# EAGLE design PARAMETRIK (EAGLE 6.6.0)
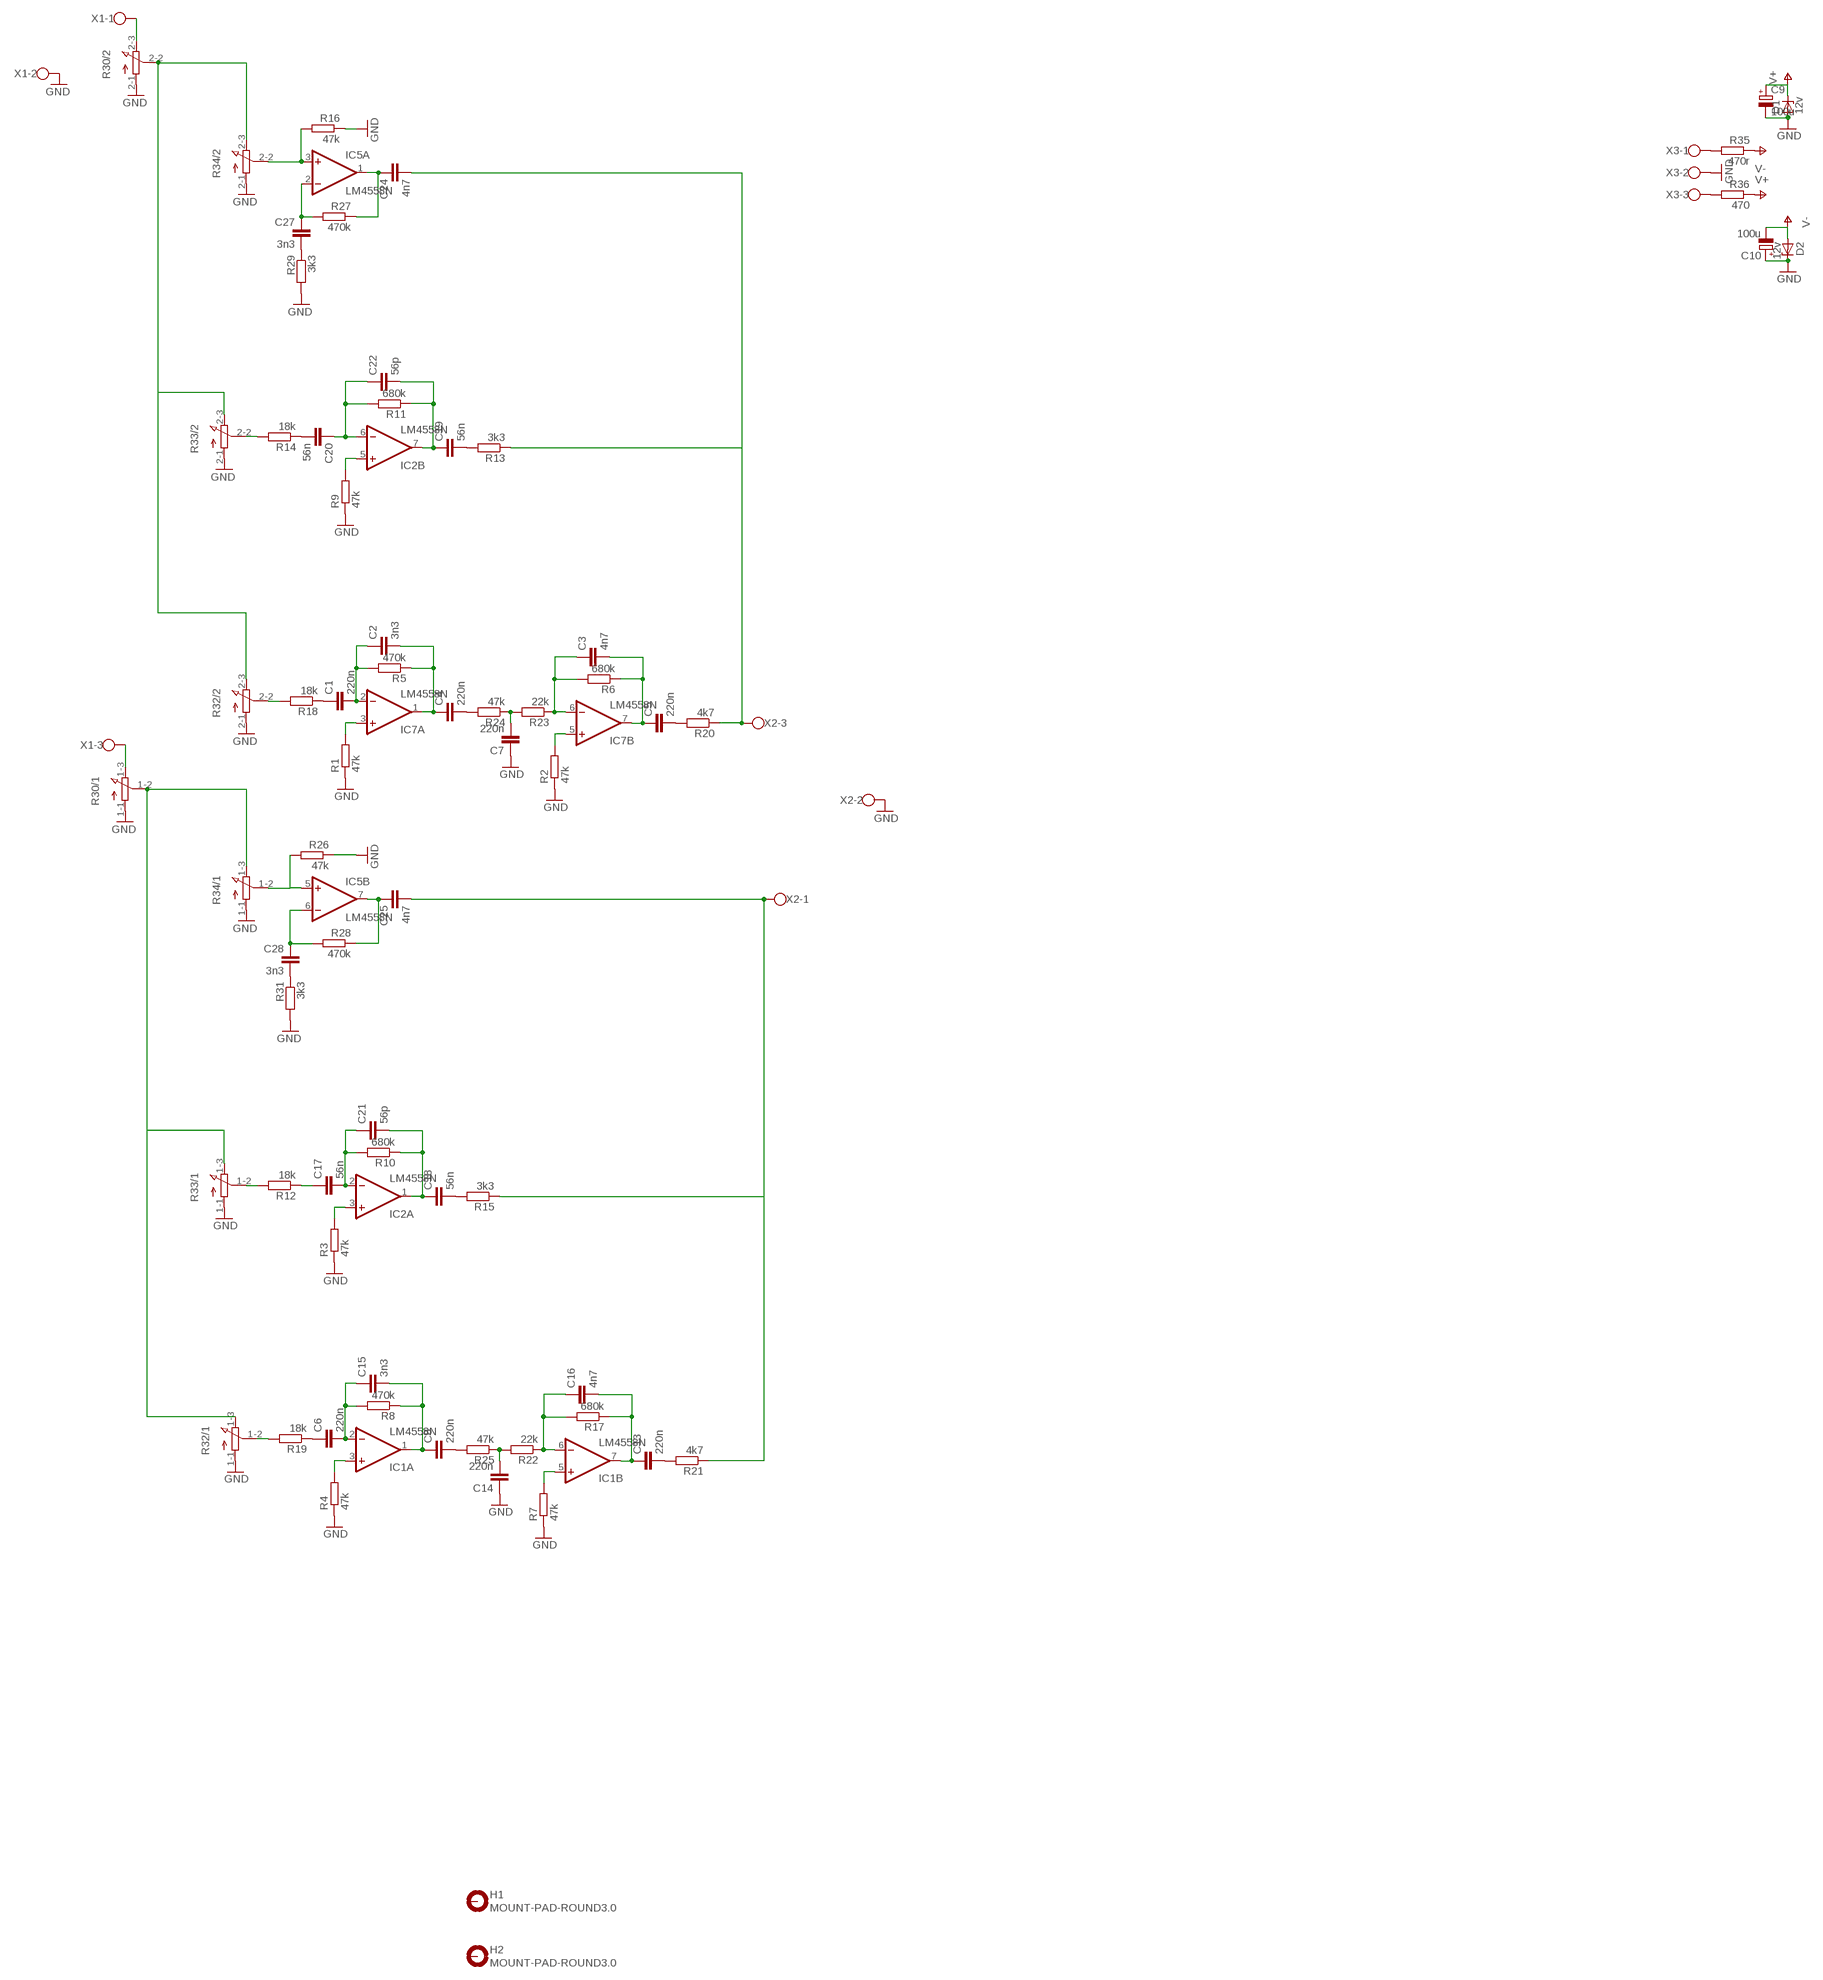
[diagram p0: schematic, sheet 1]

## Parts
C1  220n  C-EU075-032X103  [C075-032X103]
C2  3n3  C-EU025-025X050  [C025-025X050]
C3  4n7  C-EU025-025X050  [C025-025X050]
C4  220n  C-EU075-032X103  [C075-032X103]
C5  220n  C-EU075-032X103  [C075-032X103]
C6  220n  C-EU075-032X103  [C075-032X103]
C7  220n  C-EU075-032X103  [C075-032X103]
C8  220n  C-EU075-032X103  [C075-032X103]
C9  100u  CPOL-EUE2.5-6  [E2,5-6]
C10  100u  CPOL-EUE2.5-6  [E2,5-6]
C13  220n  C-EU075-032X103  [C075-032X103]
C14  220n  C-EU075-032X103  [C075-032X103]
C15  3n3  C-EU025-025X050  [C025-025X050]
C16  4n7  C-EU025-025X050  [C025-025X050]
C17  56n  C-EU075-032X103  [C075-032X103]
C18  56n  C-EU075-032X103  [C075-032X103]
C19  56n  C-EU075-032X103  [C075-032X103]
C20  56n  C-EU075-032X103  [C075-032X103]
C21  56p  C-EU025-025X050  [C025-025X050]
C22  56p  C-EU025-025X050  [C025-025X050]
C24  4n7  C-EU075-032X103  [C075-032X103]
C25  4n7  C-EU075-032X103  [C075-032X103]
C27  3n3  C-EU025-025X050  [C025-025X050]
C28  3n3  C-EU025-025X050  [C025-025X050]
D1  12v  1N821  [DO35Z10]
D2  12v  1N821  [DO35Z10]
H1  MOUNT-PAD-ROUND3.0  [3,0-PAD]
H2  MOUNT-PAD-ROUND3.0  [3,0-PAD]
IC1  LM4558N  [DIL08]
IC2  LM4558N  [DIL08]
IC5  LM4558N  [DIL08]
IC7  LM4558N  [DIL08]
R1  47k  R-EU_0207/10  [0207/10]
R2  47k  R-EU_0207/10  [0207/10]
R3  47k  R-EU_0207/10  [0207/10]
R4  47k  R-EU_0207/10  [0207/10]
R5  470k  R-EU_0207/10  [0207/10]
R6  680k  R-EU_0207/10  [0207/10]
R7  47k  R-EU_0207/10  [0207/10]
R8  470k  R-EU_0207/10  [0207/10]
R9  47k  R-EU_0207/10  [0207/10]
R10  680k  R-EU_0207/10  [0207/10]
R11  680k  R-EU_0207/10  [0207/10]
R12  18k  R-EU_0207/10  [0207/10]
R13  3k3  R-EU_0207/10  [0207/10]
R14  18k  R-EU_0207/10  [0207/10]
R15  3k3  R-EU_0207/10  [0207/10]
R16  47k  R-EU_0207/10  [0207/10]
R17  680k  R-EU_0207/10  [0207/10]
R18  18k  R-EU_0207/10  [0207/10]
R19  18k  R-EU_0207/10  [0207/10]
R20  4k7  R-EU_0207/10  [0207/10]
R21  4k7  R-EU_0207/10  [0207/10]
R22  22k  R-EU_0207/10  [0207/10]
R23  22k  R-EU_0207/10  [0207/10]
R24  47k  R-EU_0207/10  [0207/10]
R25  47k  R-EU_0207/10  [0207/10]
R26  47k  R-EU_0207/10  [0207/10]
R27  470k  R-EU_0207/10  [0207/10]
R28  470k  R-EU_0207/10  [0207/10]
R29  3k3  R-EU_0207/10  [0207/10]
R30  3RP/1610G  [3RP/1610G]
R31  3k3  R-EU_0207/10  [0207/10]
R32  3RP/1610G  [3RP/1610G]
R33  3RP/1610G  [3RP/1610G]
R34  3RP/1610G  [3RP/1610G]
R35  470r  R-EU_0207/10  [0207/10]
R36  470  R-EU_0207/10  [0207/10]
X1  W237-103  [W237-103]
X2  W237-103  [W237-103]
X3  W237-103  [W237-103]

## Nets
GND: C7.1 C9.- C10.+ C14.1 D1.A D2.C R1.1 R2.1 R3.1 R4.1 R7.1 R9.1 R16.1 R26.1 R29.2 R30.1-1(/1:A) R30.2-1(/2:A) R31.2 R32.1-1(/1:A) R32.2-1(/2:A) R33.1-1(/1:A) R33.2-1(/2:A) R34.1-1(/1:A) R34.2-1(/2:A) X1.2 X2.2 X3.2
N$1: IC1.3(A:+IN) R4.2
N$2: IC1.5(B:+IN) R7.2
N$3: IC7.3(A:+IN) R1.2
N$4: IC7.5(B:+IN) R2.2
N$5: C1.2 C2.1 IC7.2(A:-IN) R5.2
N$6: C6.2 C15.1 IC1.2(A:-IN) R8.2
N$7: C8.1 C15.2 IC1.1(A:OUT) R8.1
N$8: C16.1 IC1.6(B:-IN) R17.2 R22.1
N$9: C13.1 C16.2 IC1.7(B:OUT) R17.1
N$10: C2.2 C4.1 IC7.1(A:OUT) R5.1
N$11: C3.1 IC7.6(B:-IN) R6.2 R23.1
N$12: C3.2 C5.1 IC7.7(B:OUT) R6.1
N$13: IC2.3(A:+IN) R3.2
N$14: IC2.5(B:+IN) R9.2
N$15: C17.2 C21.1 IC2.2(A:-IN) R10.2
N$16: C18.1 C21.2 IC2.1(A:OUT) R10.1
N$17: C20.1 C22.1 IC2.6(B:-IN) R11.2
N$18: C19.1 C22.2 IC2.7(B:OUT) R11.1
N$19: C17.1 R12.1
N$20: C19.2 R13.2
N$21: C18.2 R15.2
N$22: C28.2 R31.1
N$23: C20.2 R14.1
N$24: R12.2 R33.1-2(/1:S)
N$25: C6.1 R19.1
N$26: C1.1 R18.1
N$27: C13.2 R21.2
N$28: C5.2 R20.2
N$29: C24.2 R13.1 R20.1 X2.3
N$30: IC5.3(A:+IN) R16.2 R34.2-2(/2:S)
N$31: C8.2 R25.2
N$32: C14.2 R22.2 R25.1
N$33: C4.2 R24.2
N$34: C7.2 R23.2 R24.1
N$35: IC5.5(B:+IN) R26.2 R34.1-2(/1:S)
N$36: C27.1 IC5.2(A:-IN) R27.2
N$37: C24.1 IC5.1(A:OUT) R27.1
N$38: C28.1 IC5.6(B:-IN) R28.2
N$39: C25.1 IC5.7(B:OUT) R28.1
N$40: C27.2 R29.1
N$41: C25.2 R15.1 R21.1 X2.1
N$42: R14.2 R33.2-2(/2:S)
N$43: R19.2 R32.1-2(/1:S)
N$44: R18.2 R32.2-2(/2:S)
N$45: R30.2-2(/2:S) R32.2-3(/2:E) R33.2-3(/2:E) R34.2-3(/2:E)
N$46: R35.2 X3.1
N$47: R30.1-2(/1:S) R32.1-3(/1:E) R33.1-3(/1:E) R34.1-3(/1:E)
N$48: R36.2 X3.3
N$49: R30.2-3(/2:E) X1.1
N$50: R30.1-3(/1:E) X1.3
V+: C9.+ D1.C R36.1
V-: C10.- D2.A R35.1
Unconnected: H1.B3,0(MOUNT) H2.B3,0(MOUNT)

## Power pins joined to a net without a drawn wire
V+: IC1.8(P:V+) IC2.8(P:V+) IC5.8(P:V+) IC7.8(P:V+)
V-: IC1.4(P:V-) IC2.4(P:V-) IC5.4(P:V-) IC7.4(P:V-)

## Library data of the parts
C1-C8 C13-C22 C24 C25 C27 C28 = resistor:C-EU: CAPACITOR, European symbol
C9 C10 = resistor:CPOL-EU: POLARIZED CAPACITOR, European symbol
D1 D2 = diode:1N821: Reference DIODE temperature compensated, 6,2 V
H1 H2 = holes:MOUNT-PAD-ROUND: MOUNTING PAD, round
IC1 IC2 IC5 IC7 = linear:*4558: OP AMP
R1-R29 R31 R35 R36 = resistor:R-EU_: RESISTOR, European symbol
R30 R32-R34 = pot:3RP/1610G: 16mm Potentiometer two level Source: http://www.alphapotentiometers.net/html/16mm_pot_2.html
X1-X3 = con-wago-500:W237-103: WAGO SCREW CLAMP; MPN: 237-103; OC_FARNELL: unknown; OC_NEWARK: 18M7116

## Board
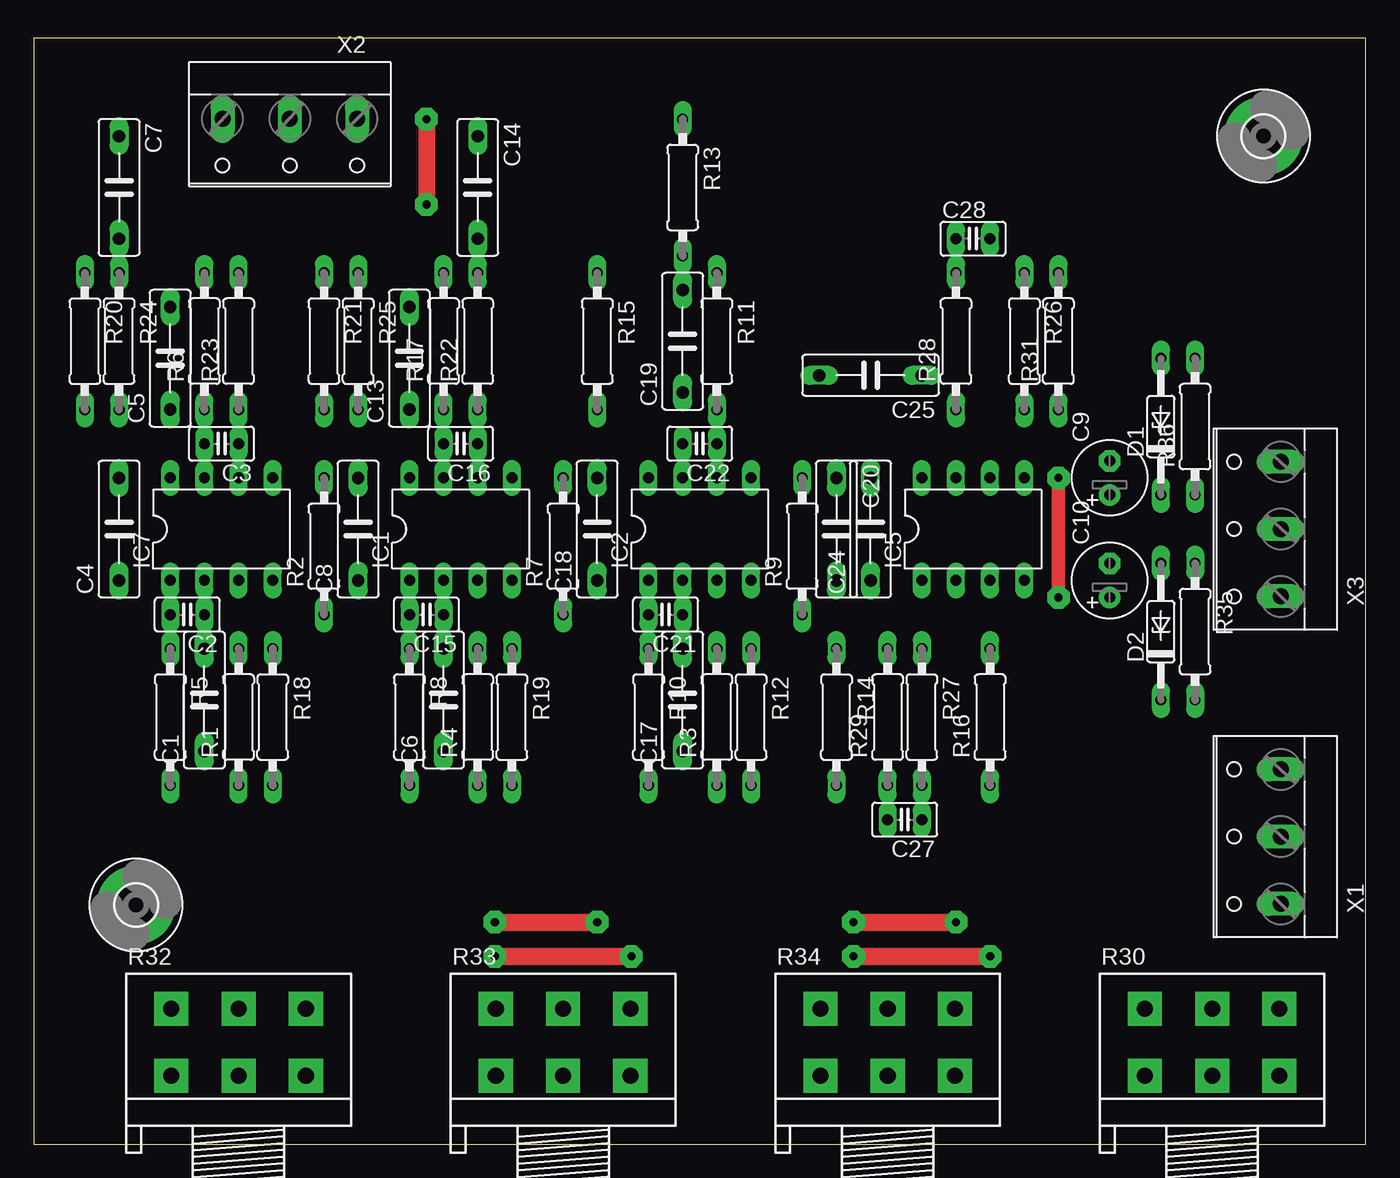
[diagram p1: board, top side]
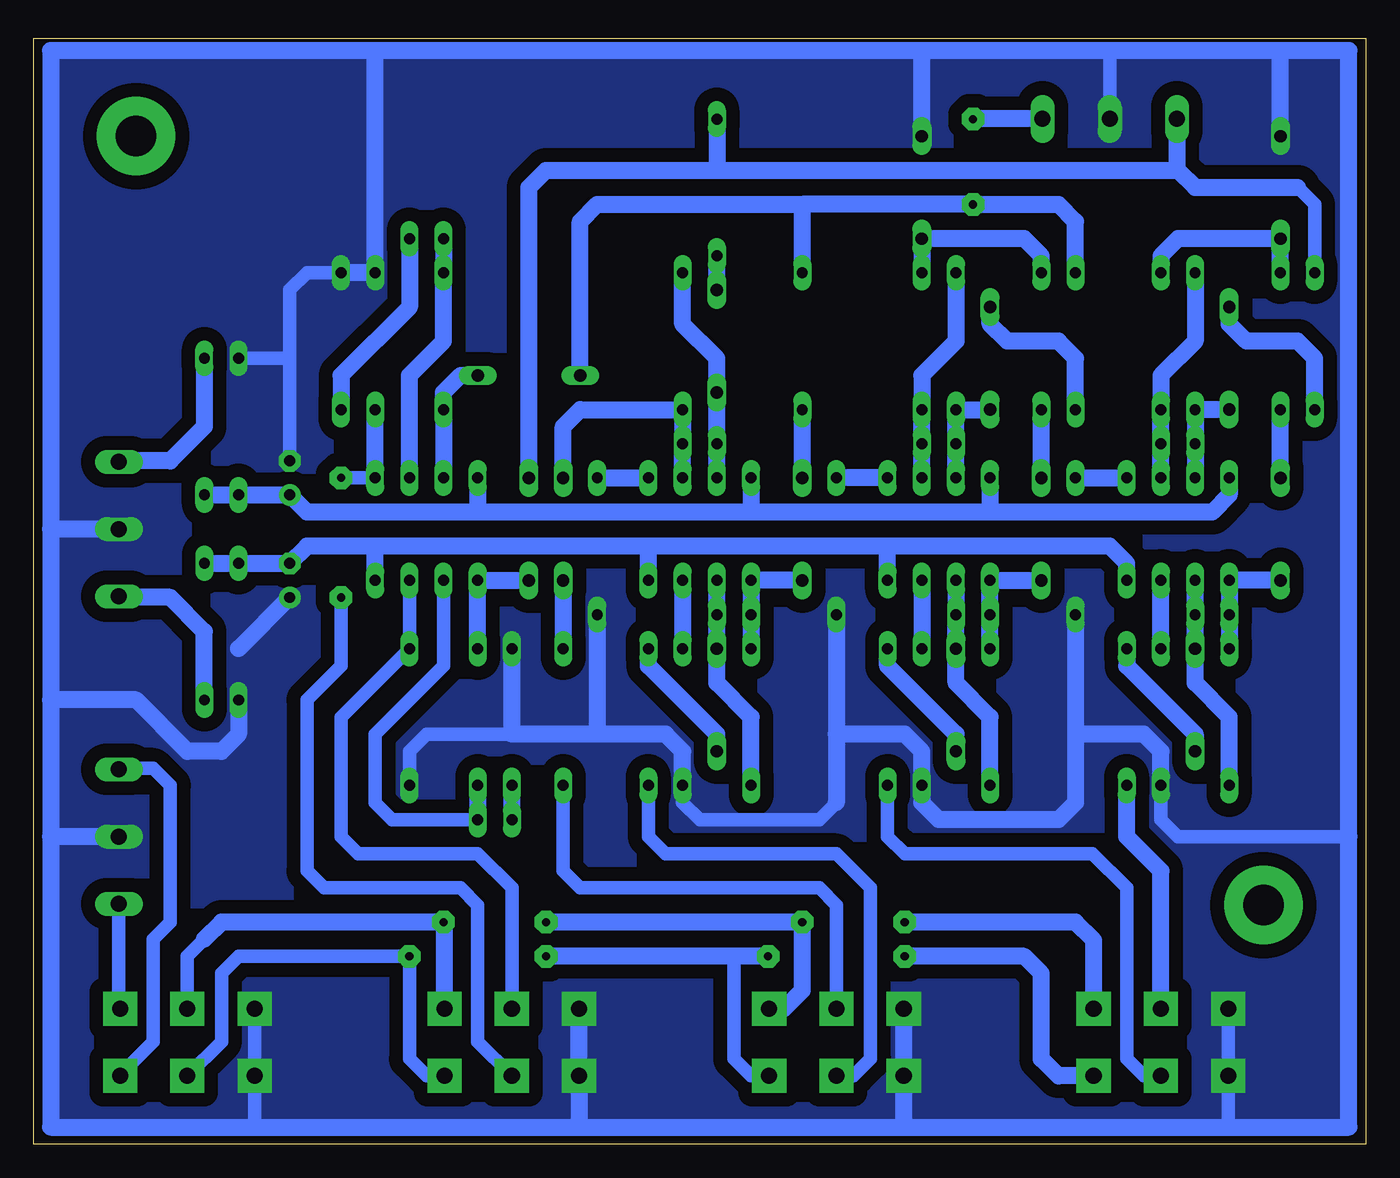
[diagram p2: board, bottom side, seen from below]

Size 99.04 x 82.22 mm. Coordinates in mm from the lower left corner, seen from the top.
Outline: 0,0 99.04,0 99.04,82.22 0,82.22 0,0
Copper layers (1*16): Top 0.035mm / dielectric 1.5mm / Bottom 0.035mm
Design rules "default": minimum track width 10mil, minimum drill 24mil, track to track 8mil, track to pad 8mil, pad to pad 8mil, via to via 8mil, smd to smd 8mil, copper to edge 40mil, drill to drill 8mil, minimum pad ring 10mil, minimum via ring 8mil, stop-mask expansion 4mil, vias tented up to drill 0mil, thermal gap 10mil

### Footprints (pad centres in the part's own frame; a part is rotated, then mirrored left to right if it is on the bottom)
C075-032X103 = drill 0.914 long: 1 -3.81,0; 2 3.81,0
C025-025X050 = drill 0.813 long: 1 -1.27,0; 2 1.27,0
E2,5-6 = drill 0.813 pad 1.6: + -1.27,0 | drill 0.813 pad 1.6 octagon: - 1.27,0
DO35Z10 = drill 0.813 long: A 5.08,0; C -5.08,0
3,0-PAD = drill 3 pad 5.842: B3,0 0,0
DIL08 = drill 0.813 pad 1.27 long: 1 -3.81,-3.81; 2 -1.27,-3.81; 3 1.27,-3.81; 4 3.81,-3.81; 5 3.81,3.81; 6 1.27,3.81; 7 -1.27,3.81; 8 -3.81,3.81
0207/10 = drill 0.813 long: 1 -5.08,0; 2 5.08,0
3RP/1610G = drill 1.2 pad 2.54 square: 1-1 -5,0; 1-2 0,0; 1-3 5,0; 2-1 -5,5; 2-2 0,5; 2-3 5,5
W237-103 = drill 1.194 long: 1 -5,-1.29; 2 0,-1.29; 3 5,-1.29

### Placement (x,y rotation side)
C1  12.7,33.02 90 top
C2  11.43,39.37 180 top
C3  13.97,52.07 180 top
C4  6.35,45.72 90 top
C5  10.16,58.42 90 top
C6  30.48,33.02 90 top
C7  6.35,71.12 270 top
C8  24.13,45.72 90 top
C9  80.01,49.53 90 top
C10  80.01,41.91 90 top
C13  27.94,58.42 90 top
C14  33.02,71.12 270 top
C15  29.21,39.37 180 top
C16  31.75,52.07 180 top
C17  48.26,33.02 90 top
C18  41.91,45.72 90 top
C19  48.26,59.69 90 top
C20  59.69,45.72 270 top
C21  46.99,39.37 180 top
C22  49.53,52.07 180 top
C24  62.23,45.72 90 top
C25  62.23,57.15 180 top
C27  64.77,24.13 180 top
C28  69.85,67.31 0 top
D1  83.82,53.34 90 top
D2  83.82,38.1 90 top
H1  91.44,74.93 0 top
H2  7.62,17.78 0 top
IC1  31.75,45.72 0 top
IC2  49.53,45.72 0 top
IC5  69.85,45.72 0 top
IC7  13.97,45.72 0 top
R1  15.24,31.75 90 top
R2  21.59,44.45 90 top
R3  50.8,31.75 90 top
R4  33.02,31.75 90 top
R5  10.16,31.75 270 top
R6  12.7,59.69 90 top
R7  39.37,44.45 90 top
R8  27.94,31.75 270 top
R9  57.15,44.45 90 top
R10  45.72,31.75 270 top
R11  50.8,59.69 270 top
R12  53.34,31.75 270 top
R13  48.26,71.12 270 top
R14  59.69,31.75 270 top
R15  41.91,59.69 270 top
R16  71.12,31.75 90 top
R17  30.48,59.69 90 top
R18  17.78,31.75 270 top
R19  35.56,31.75 270 top
R20  3.81,59.69 270 top
R21  21.59,59.69 270 top
R22  33.02,59.69 90 top
R23  15.24,59.69 90 top
R24  6.35,59.69 270 top
R25  24.13,59.69 270 top
R26  73.66,59.69 270 top
R27  66.04,31.75 270 top
R28  68.58,59.69 90 top
R29  63.5,31.75 90 top
R30  87.63,5.08 0 top
R31  76.2,59.69 90 top
R32  15.24,5.08 0 top
R33  39.37,5.08 0 top
R34  63.5,5.08 0 top
R35  86.36,38.1 270 top
R36  86.36,53.34 90 top
X1  91.44,22.86 90 top
X2  19.05,74.93 180 top
X3  91.44,45.72 90 top

### Tracks (layer width: path | path; a pad name or v marks a point on that pad's centre or on a via)
GND
  Bottom 1.016: 1.27,22.86 13.97,22.86 15.24,24.13 R1.1 | R3.1 50.8,25.4 49.53,24.13 40.64,24.13 39.37,25.4 | R16.1 71.12,29.21 69.85,30.48 63.5,30.48 | R32.2-1 R32.1-1 10.24,1.35 10.16,1.27 | 82.55,1.27 82.63,1.35 R30.1-1 R30.2-1 | C9.- 80.01,58.42 | 80.01,58.42 80.01,63.5 78.74,64.77 R31.2 | D1.A 80.01,58.42 | X2.2 19.05,81.28
  Bottom 1.27: 6.35,81.28 1.27,81.28 1.27,22.86 1.27,1.27 10.16,1.27 34.29,1.27 | 33.02,81.28 19.05,81.28 6.35,81.28 | 33.02,81.28 73.66,81.28 | 73.66,81.28 97.79,81.28 97.79,45.72 | 97.79,45.72 97.79,33.02 | 97.79,33.02 97.79,22.86 | 97.79,22.86 97.79,1.27 82.55,1.27 58.42,1.27 | 58.42,1.27 34.29,1.27 | R3.1 50.8,29.21 52.07,30.48 57.15,30.48 | 57.15,30.48 63.5,30.48 R29.2 | R31.2 R26.1 73.66,81.28 | 34.29,1.27 34.37,1.35 R33.1-1 R33.2-1 | 58.42,1.27 58.5,1.35 R34.1-1 R34.2-1 | C7.1 6.35,81.28 | R7.1 39.37,30.48 | 39.37,30.48 39.37,25.4 | C14.1 33.02,81.28 | R9.1 57.15,30.48 | 39.37,30.48 34.29,30.48 33.02,29.21 R4.1 33.02,25.4 31.75,24.13 22.86,24.13 21.59,25.4 21.59,30.48 | R2.1 21.59,30.48 | R1.1 15.24,29.21 16.51,30.48 21.59,30.48 | X3.2 97.79,45.72 | X1.2 97.79,22.86 | C10.+ 83.82,36.83 | D2.C 83.82,30.48 85.09,29.21 87.63,29.21 91.44,33.02 97.79,33.02
  pour Bottom (isolate 1.016, no thermals): 0,0 0,82.55 99.06,82.55 99.06,0
N$1
  Bottom 1.27: IC1.3 R4.2
N$2
  Bottom 1.27: IC1.5 R7.2
N$3
  Bottom 1.27: R1.2 IC7.3
N$4
  Bottom 1.27: R2.2 IC7.5
N$5
  Bottom 1.27: IC7.2 C2.1 C1.2 12.7,34.29 10.16,31.75 R5.2
N$6
  Bottom 1.27: IC1.2 C15.1 C6.2 30.48,34.29 27.94,31.75 R8.2
N$7
  Bottom 1.27: R8.1 C15.2 IC1.1 C8.1
N$8
  Bottom 1.27: R17.2 30.48,59.69 33.02,57.15 R22.1 C16.1 IC1.6
N$9
  Bottom 1.27: IC1.7 C16.2 R17.1 C13.1
N$10
  Bottom 1.27: R5.1 C2.2 IC7.1 C4.1
N$11
  Bottom 1.27: IC7.6 C3.1 R23.1 15.24,57.15 12.7,59.69 R6.2
N$12
  Bottom 1.27: IC7.7 C3.2 R6.1 C5.1
N$13
  Bottom 1.27: IC2.3 R3.2
N$14
  Bottom 1.27: R9.2 IC2.5
N$15
  Bottom 1.27: IC2.2 C21.1 C17.2 48.26,34.29 45.72,31.75 R10.2
N$16
  Bottom 1.27: C18.1 IC2.1 C21.2 R10.1
N$17
  Bottom 1.27: IC2.6 C22.1 R11.2 58.42,54.61 59.69,53.34 C20.1
N$18
  Bottom 1.27: IC2.7 C22.2 C19.1 48.26,58.42 50.8,60.96 R11.1
N$19
  Bottom 1.27: C17.1 48.26,30.48 53.34,35.56 R12.1
N$20
  Bottom 1.27: C19.2 R13.2
N$21
  Bottom 1.27: C18.2 R15.2
N$22
  Bottom 1.27: C28.2 71.12,62.23 76.2,57.15 R31.1
N$23
  Bottom 1.27: C20.2 R14.1
N$24
  Bottom 1.016: R33.1-2 38.1,5.08 36.83,6.35 36.83,19.05 39.37,21.59 52.07,21.59 53.34,22.86 R12.2
N$25
  Bottom 1.27: C6.1 30.48,30.48 35.56,35.56 R19.1
N$26
  Bottom 1.27: R18.1 17.78,35.56 12.7,30.48 C1.1
N$27
  Bottom 1.27: R21.2 21.59,58.42 22.86,59.69 26.67,59.69 27.94,60.96 C13.2
N$28
  Bottom 1.27: R20.2 3.81,58.42 5.08,59.69 8.89,59.69 10.16,60.96 C5.2
N$29
  Bottom 1.016: R20.1 3.81,69.85 5.08,71.12
  Bottom 1.27: C24.2 62.23,71.12 60.96,72.39 48.26,72.39 | 48.26,72.39 13.97,72.39 | 13.97,72.39 12.7,71.12 5.08,71.12 | R13.1 48.26,72.39 | X2.3 14.05,72.47 13.97,72.39
N$30
  Bottom 1.016: IC5.3 R16.2 76.2,31.75 76.2,22.86 74.93,21.59 66.04,21.59 63.5,19.05 R34.2-2
N$31
  Bottom 1.27: C8.2 R25.2
N$32
  Bottom 1.27: R25.1 24.13,66.04 25.4,67.31 C14.2 R22.2
N$33
  Bottom 1.27: C4.2 R24.2
N$34
  Bottom 1.27: R24.1 C7.2 13.97,67.31 15.24,66.04 R23.2
N$35  (via drill 0.6 pad 1.68)
  Top 1.016: v76.2,49.53 v76.2,40.64
  Bottom 1.016: IC5.5 v76.2,49.53 | v76.2,40.64 76.2,35.56 78.74,33.02 78.74,20.32 77.47,19.05 67.31,19.05 66.04,17.78 66.04,7.62 R34.1-2
  Bottom 1.27: IC5.5 R26.2
N$36
  Bottom 1.016: IC5.2 68.58,35.56 73.66,30.48 73.66,25.4 72.39,24.13 C27.1
  Bottom 1.27: R27.2 C27.1
N$37
  Bottom 1.27: C24.1 IC5.1 R27.1
N$38
  Bottom 1.27: IC5.6 71.12,57.15 68.58,59.69 R28.2 C28.1
N$39
  Bottom 1.27: IC5.7 R28.1 68.58,55.88 67.31,57.15 C25.1
N$40
  Bottom 1.27: C27.2 R29.1
N$41  (via drill 0.6 pad 1.68)
  Top 1.27: v29.21,76.2 v29.21,69.85
  Bottom 1.27: C25.2 58.42,68.58 57.15,69.85 41.91,69.85 | R15.1 41.91,69.85 | R21.1 21.59,68.58 22.86,69.85 v29.21,69.85 41.91,69.85 | X2.1 29.19,76.22 v29.21,76.2
N$42
  Bottom 1.016: R33.2-2 39.37,17.78 40.64,19.05 58.42,19.05 59.69,20.32 R14.2
N$43
  Bottom 1.016: R32.1-2 16.51,5.08 17.78,6.35 17.78,19.05 20.32,21.59 34.29,21.59 35.56,22.86 R19.2
N$44
  Bottom 1.27: R32.2-2 15.24,20.32 17.78,22.86 R18.2
N$45  (via drill 0.6 pad 1.68)
  Top 1.27: v34.29,16.51 v41.91,16.51 | v60.96,16.51 v68.58,16.51
  Bottom 1.016: R30.2-2 87.63,13.97 86.36,15.24
  Bottom 1.27: R32.2-3 20.24,15.16 21.59,16.51 v34.29,16.51 | v60.96,16.51 v41.91,16.51 41.91,11.43 43.26,10.08 R33.2-3 | 86.36,15.24 85.09,16.51 v68.58,16.51 68.5,16.43 R34.2-3
N$46
  Bottom 1.27: R35.2 86.36,38.1 88.9,40.64 92.65,40.64 X3.1
N$47  (via drill 0.6 pad 1.68)
  Top 1.27: v34.29,13.97 v44.45,13.97 | v60.96,13.97 v71.12,13.97
  Bottom 1.016: R34.1-3 69.85,5.08 71.12,6.35 v71.12,13.97 83.82,13.97 85.09,12.7 85.09,7.62 R30.1-2 | R33.1-3 45.72,5.08 46.99,6.35 46.99,13.97
  Bottom 1.27: R32.1-3 22.86,5.08 24.13,6.35 24.13,12.7 25.4,13.97 v34.29,13.97 | v44.45,13.97 46.99,13.97 v60.96,13.97
N$48
  Bottom 1.27: R36.2 86.36,53.34 88.9,50.8 92.65,50.8 X3.3
N$49
  Bottom 1.016: X1.1 92.73,10.18 R30.2-3
N$50
  Bottom 1.016: R30.1-3 92.63,5.16 90.17,7.62 90.17,15.24 88.9,16.51 88.9,26.67 90.17,27.94 92.65,27.94 X1.3
V+
  Bottom 1.27: IC7.8 10.16,48.26 11.43,46.99 27.94,46.99 | IC1.8 27.94,46.99 | 27.94,46.99 45.72,46.99 | 45.72,46.99 66.04,46.99 | 66.04,46.99 78.74,46.99 C9.+ D1.C R36.1 | IC2.8 45.72,46.99 | IC5.8 66.04,46.99
V-
  Bottom 1.27: IC7.4 17.78,43.18 19.05,44.45 35.56,44.45 | IC1.4 35.56,44.45 | 35.56,44.45 53.34,44.45 | 53.34,44.45 73.66,44.45 | 73.66,44.45 78.74,44.45 C10.- D2.A R35.1 | IC2.4 53.34,44.45 | IC5.4 73.66,44.45